# EAGLE design Nanite 841 - Minib v1.0 (EAGLE 6.5.0)
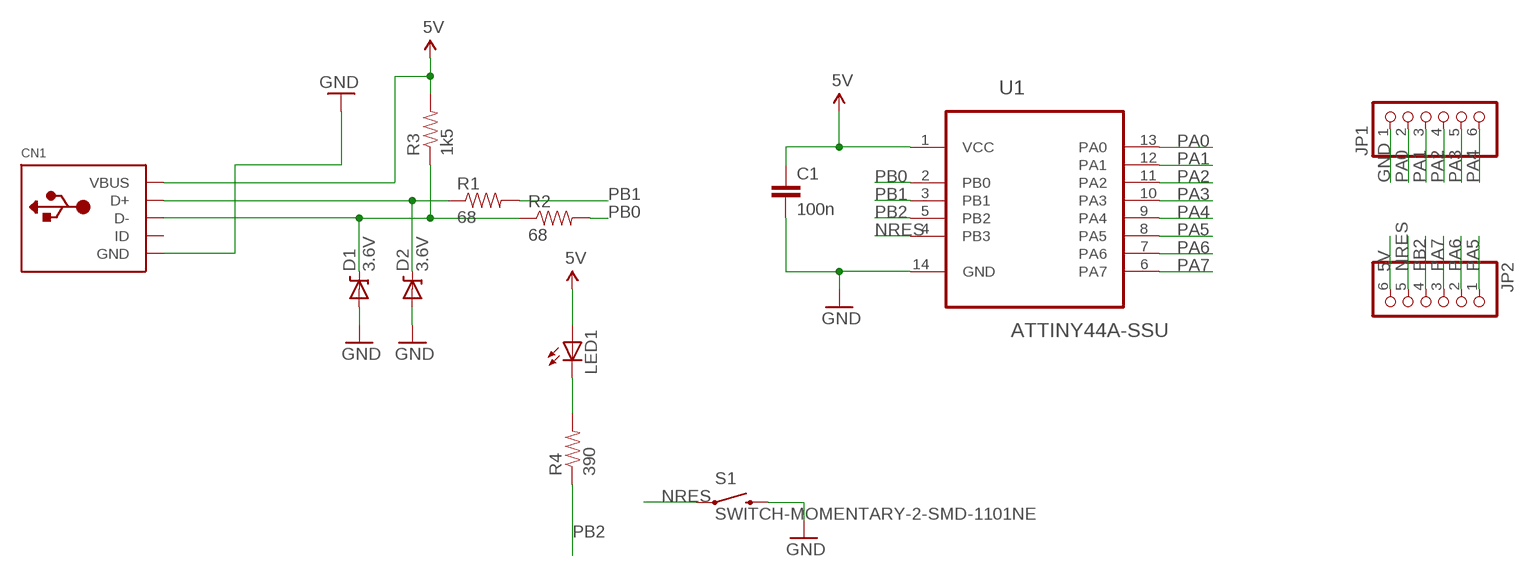
[diagram p0: schematic, sheet 1]

## Parts
C1  100n  CAP0805  [0805]
CN1  USBMINIB  [USB-MINIB]
D1  3.6V  DIODE-ZENER-BZT52  [SOD-323]
D2  3.6V  DIODE-ZENER-BZT52  [SOD-323]
JP1  HEADER-1X6ROUND  [1X06_ROUND]
JP2  HEADER-1X6ROUND  [1X06_ROUND]
LED1  LEDCHIPLED_0805  [CHIPLED_0805]
R1  68  RESISTOR0805-RES  [0805]
R2  68  RESISTOR0805-RES  [0805]
R3  1k5  RESISTOR0805-RES  [0805]
R4  390  RESISTOR0805-RES  [0805]
S1  SWITCH-MOMENTARY-2-SMD-1101NE  [TACTILE-SWITCH-1101NE]
U1  ATTINY44A-SSU  [SOIC127P600X175-14N]

## Nets
5V [Power]: C1.1 CN1.VBUS JP2.6 LED1.A R3.2 U1.1(VCC)
GND [Power]: C1.2 CN1.GND D1.2(A) D2.2(A) JP1.1 S1.P$2 U1.14(GND)
N$1: CN1.D- D1.1(C) R2.1 R3.1
N$2: CN1.D+ D2.1(C) R1.1
N$3: LED1.C R4.2
NRES: JP2.5 S1.P$1 U1.4(PB3)
PA0: JP1.2 U1.13(PA0)
PA1: JP1.3 U1.12(PA1)
PA2: JP1.4 U1.11(PA2)
PA3: JP1.5 U1.10(PA3)
PA4: JP1.6 U1.9(PA4)
PA5: JP2.1 U1.8(PA5)
PA6: JP2.2 U1.7(PA6)
PA7: JP2.3 U1.6(PA7)
PB0: R2.2 U1.2(PB0)
PB1: R1.2 U1.3(PB1)
PB2: JP2.4 R4.1 U1.5(PB2)
Unconnected: CN1.ID

## Library data of the parts
C1 = SparkFun-Capacitors:CAP: Capacitor Standard 0603 ceramic capacitor, and 0.1" leaded capacitor.
CN1 = microbuilder:USB: USB Connectors USBMINIB - Surface Mount Female Mini-B USB Connector 4UConnector: 06564
D1 D2 = SparkFun-DiscreteSemi:DIODE-ZENER: Zener Diode Production Part - 8199 3.4V Zener Voltage
JP1 JP2 = microbuilder:HEADER-1X6: PIN HEADER
LED1 = led:LED: LED OSRAM: - CHIPLED LG R971, LG N971, LY N971, LG Q971, LY Q971, LO R971, LY R971 LH N974, LH R974 LS Q976, LO Q976, LY Q976 LO Q996 - Hyper CHIPLED LW Q18S LB Q993, LB Q99A, LB R99A - SideLED LS A670, LO A670, LY A670, LG A670, LP A670 LB A673, LV A673, LT A673, LW A673 LH A674 LY A675 LS A676, LA A676, LO A676, LY A676, LW A676 LS A679, LY A679, LG A679 - Hyper Micro SIDELED® LS Y876, LA Y876, LO Y876, LY Y876 LT Y87S - SmartLED LW L88C, LW L88S LB L89C, LB L89S, LG L890 LS L89K, LO L89K, LY L89K LS L896, LA L896, LO L896, LY L896 - TOPLED LS T670, LO T670, LY T670, LG T670, LP T670 LSG T670, LSP T670, LSY T670, LOP T670, LYG T670 LG T671, LOG T671, LSG T671 LB T673, LV T673, LT T673, LW T673 LH T674 LS T676, LA T676, LO T676, LY T676, LB T676, LH T676, LSB T676, LW T676 LB T67C, LV T67C, LT T67C, LS T67K, LO T67K, LY T67K, LW E67C LS E67B, LA E67B, LO E67B, LY E67B, LB E67C, LV E67C, LT E67C LW T67C LS T679, LY T679, LG T679 LS T770, LO T770, LY T770, LG T770, LP T770 LB T773, LV T773, LT T773, LW T773 LH T774 LS E675, LA E675, LY E675, LS T675 LS T776, LA T776, LO T776, LY T776, LB T776 LHGB T686 LT T68C, LB T68C - Hyper Mini TOPLED® LB M676 - Mini TOPLED Santana® LG M470 LS M47K, LO M47K, LY M47K Source: http://www.osram.convergy.de LUXEON: - LUMILED® LXK2-PW12-R00, LXK2-PW12-S00, LXK2-PW14-U00, LXK2-PW14-V00 LXK2-PM12-R00, LXK2-PM12-S00, LXK2-PM14-U00 LXK2-PE12-Q00, LXK2-PE12-R00, LXK2-PE12-S00, LXK2-PE14-T00, LXK2-PE14-U00 LXK2-PB12-K00, LXK2-PB12-L00, LXK2-PB12-M00, LXK2-PB14-N00, LXK2-PB14-P00, LXK2-PB14-Q00 LXK2-PR12-L00, LXK2-PR12-M00, LXK2-PR14-Q00, LXK2-PR14-R00 LXK2-PD12-Q00, LXK2-PD12-R00, LXK2-PD12-S00 LXK2-PH12-R00, LXK2-PH12-S00 LXK2-PL12-P00, LXK2-PL12-Q00, LXK2-PL12-R00 Source: www.luxeon.com KINGBRIGHT: KA-3528ASYC Source: www.kingbright.com
R1-R4 = SparkFun-Passives:RESISTOR: Resistor Basic schematic elements and footprints for 0603, 1206, and PTH resistors.
S1 = SparkFun-Electromechanical:SWITCH-MOMENTARY-2: Various NO switches- pushbuttons, reed, etc
U1 = Atmel_By_element14_Batch_1:ATTINY44A-SSU: 8-bit Microcontroller with In-System Programmable Flash; MPN: ATTINY44A-SSU; OC_FARNELL: 1699397; OC_NEWARK: 80P3683; PACKAGE: SOIC-14; SUPPLIER: Atmel

## Net classes
0 default: width 0.254 mm, clearance 0.152 mm
1 Power: width 0.305 mm, clearance 0.254 mm

## Board
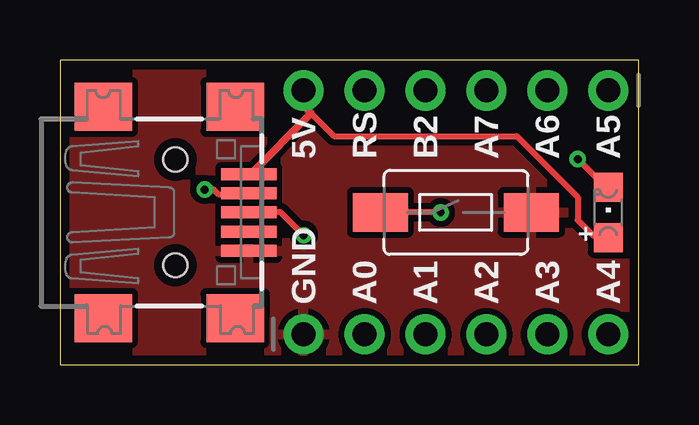
[diagram p1: board, top side]
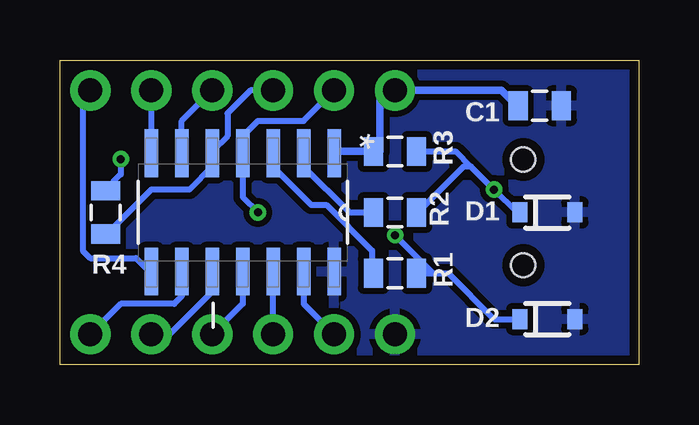
[diagram p2: board, bottom side, seen from below]

Size 24.13 x 12.7 mm. Coordinates in mm from the lower left corner, seen from the top.
Outline: 24.13,0 24.13,12.7 0,12.7 0,0 24.13,0
Copper layers (1*16): Top 0.0356mm / dielectric 1.5011mm / Bottom 0.0356mm
Design rules "LaenPCBOrder *": minimum track width 6mil, minimum drill 13mil, track to track 6mil, track to pad 6mil, pad to pad 6mil, via to via 6mil, smd to smd 6mil, copper to edge 15mil, drill to drill 6mil, minimum pad ring 7mil, minimum via ring 7mil, stop-mask expansion 0mil, vias tented up to drill 0mil, thermal gap 10mil

### Footprints (pad centres in the part's own frame; a part is rotated, then mirrored left to right if it is on the bottom)
0805 = smd 0.8 x 1.2: 1 -0.9,0; 2 0.9,0
USB-MINIB = smd 0.5 x 2.308: D+ 0,4.064; D- -0.8,4.064; GND 1.6,4.064; ID 0.8,4.064; VBUS -1.6,4.064 | smd 2 x 2.4: GND1 -4.4,-2; GND2 -4.4,3.5; GND3 4.4,3.5; GND4 4.4,-2 | hole 1: -2.2,1; 2.2,1
SOD-323 = smd 0.63 x 0.83: 1 -1.15,0; 2 1.15,0
1X06_ROUND = drill 1 pad 1.676: 1 -6.35,0; 2 -3.81,0; 3 -1.27,0; 4 1.27,0; 5 3.81,0; 6 6.35,0
CHIPLED_0805 = smd 1.2 x 1.2: A 0,-1.05; C 0,1.05
TACTILE-SWITCH-1101NE = smd 2.3 x 1.6: P$1 -3.15,0; P$2 3.15,0
SOIC127P600X175-14N = smd 1.981 x 0.559: 1 -2.464,3.81; 2 -2.464,2.54; 3 -2.464,1.27; 4 -2.464,0; 5 -2.464,-1.27; 6 -2.464,-2.54; 7 -2.464,-3.81; 8 2.464,-3.81; 9 2.464,-2.54; 10 2.464,-1.27; 11 2.464,0; 12 2.464,1.27; 13 2.464,2.54; 14 2.464,3.81

### Placement (x,y rotation side)
C1  4.13,10.79 0 bottom
CN1  3.81,6.35 270 top
D1  3.81,6.35 0 bottom
D2  3.81,1.91 0 bottom
JP1  16.51,1.27 0 top
JP2  16.51,11.43 180 top
LED1  22.86,6.35 0 top
R1  10.16,3.81 180 bottom
R2  10.16,6.35 180 bottom
R3  10.16,8.89 180 bottom
R4  22.23,6.35 90 bottom
S1  16.51,6.35 0 top
U1  16.51,6.35 270 bottom

### Tracks (layer width: path | path; a pad name or v marks a point on that pad's centre or on a via)
5V
  Top 0.254: 10.48,10.48 11.43,9.53 19.05,9.53 21.59,6.99 21.59,6.03 22.23,5.4 22.76,5.4 LED1.A
  Top 0.305: JP2.6 10.16,10.79 10.48,10.48 7.94,7.94 CN1.VBUS | 22.86,5.4 LED1.A
  Bottom 0.305: U1.1 12.7,8.89 R3.2 10.79,8.89 10.79,11.43 JP2.6 5.71,11.43 5.08,10.79 C1.1
GND
  pour Bottom: -1.27,16.51 26.67,16.51 26.67,-1.27 -1.27,-1.27
  pour Top: -2.54,15.24 27.94,15.24 27.94,-2.54 -2.54,-2.54
N$1  (via drill 0.33)
  Top 0.254: v6.03,7.3 6.41,7.3 6.6,7.11 7.84,7.11 CN1.D-
  Bottom 0.254: 6.99,8.26 7.62,8.89 R3.1 | 6.99,8.26 v6.03,7.3 5.08,6.35 D1.1 | 6.99,8.26 7.3,8.26 9.21,6.35 R2.1
N$2  (via drill 0.33)
  Top 0.254: CN1.D+ 9.21,6.35 v10.16,5.4
  Bottom 0.254: 9.53,3.81 R1.1 | D2.1 6.03,1.91 7.94,3.81 8.57,3.81 | R1.1 8.89,3.81 | 8.89,3.81 8.57,3.81 | 9.53,3.49 9.21,3.49 8.89,3.81 | 9.21,3.81 R1.1 | 8.57,3.81 v10.16,5.4
N$3  (via drill 0.33)
  Top 0.254: v21.59,8.57 22.86,7.3 LED1.C
  Bottom 0.254: v21.59,8.57 21.59,7.94 22.23,7.3 R4.2
NRES  (via drill 0.33)
  Top 0.254: v15.88,6.35 S1.P$1
  Bottom 0.254: v15.88,6.35 16.51,6.99 U1.4 16.51,9.53 15.88,10.16 13.97,10.16 JP2.5
PA0
  Bottom 0.254: U1.13 13.97,2.54 JP1.2
PA1
  Bottom 0.254: JP1.3 U1.12
PA2
  Bottom 0.254: U1.11 16.51,2.54 JP1.4
PA3
  Bottom 0.254: U1.10 17.78,3.05 19.56,1.27 JP1.5
PA4
  Bottom 0.254: U1.9 19.05,2.86 19.37,2.54 21.59,2.54 JP1.6
PA5
  Bottom 0.254: 20.32,4.13 U1.8 20.32,3.81 20.95,4.45 22.86,4.45 23.18,4.76 23.18,11.43 JP2.1
PA6
  Bottom 0.254: JP2.2 U1.7
PA7
  Bottom 0.254: U1.6 19.05,10.16 JP2.3
PB0
  Bottom 0.254: R2.2 12.06,6.35 13.97,8.26 U1.2
PB1
  Bottom 0.254: U1.3 15.24,8.26 13.65,6.67 13.02,6.67 11.11,4.76 11.11,3.81 R1.2
PB2
  Bottom 0.254: JP2.4 16.19,11.43 17.14,10.48 17.14,9.53 17.78,8.89 U1.5 17.78,8.26 18.73,7.3 20.32,7.3 22.23,5.4 R4.1

### Text on the board
tPlace: 5V | RS | B2 | A7 | A6 | A5 | + | GND | A0 | A1 | A2 | A3 | A4
bPlace: C1 | R3 | R3 | D1 | R2 | R1 | R4 | D2